# Altium schematic sheet connector.SchDoc
size A4; SPICEModelCacheDOTMRQIM: <root> / <DocumentId>DOTMRQIM</DocumentId> / <CacheFrame Number="0"> / <Model Name="npn" Kind="MDL"> / <Text>*Default NPN BJT / *NPN Trans Pinout: C,B,E / .MODEL NPN NPN()</Text> / </Model> / </CacheFrame> / </root>
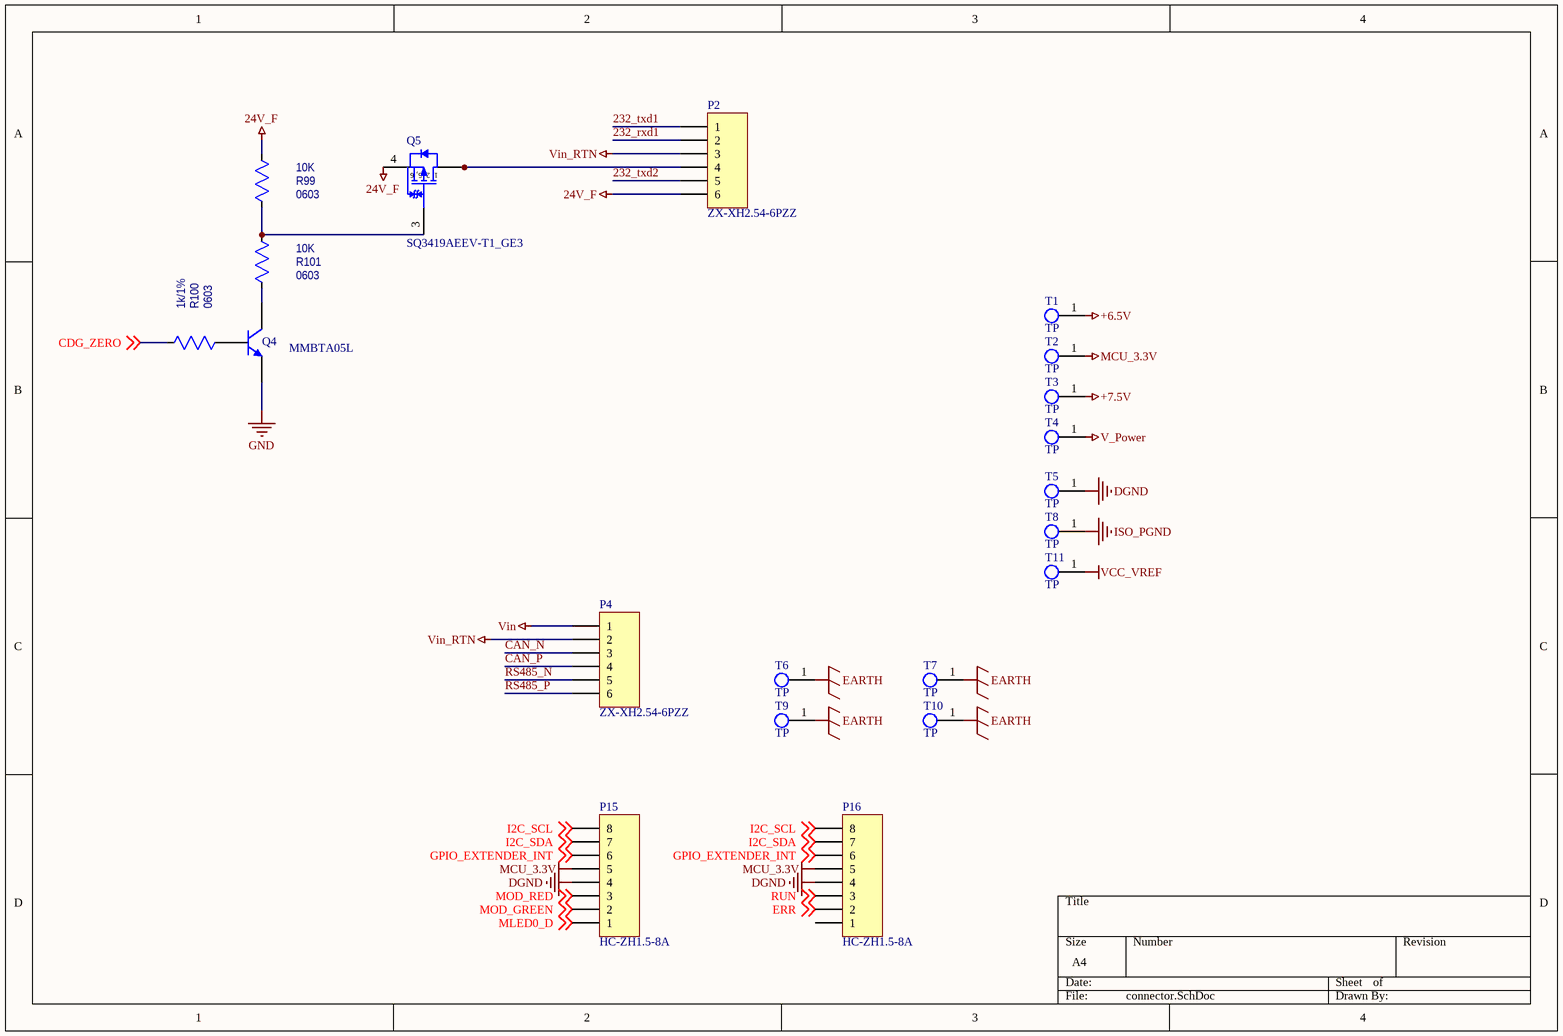
[diagram p0: connector.SchDoc]

## Parts
P2  ZX-XH2.54-6PZZ  [6X2.54MMZ]
P4  ZX-XH2.54-6PZZ  [6X2.54MMZ]
P15  HC-ZH1.5-8A  [CONN-TH_HC-ZH1.5-8A]
P16  HC-ZH1.5-8A  [CONN-TH_HC-ZH1.5-8A]
Q4  MMBTA05L  [sot23-3]
Q5  SQ3419AEEV-T1_GE3  [VISH-TSOP-6_V]  (no BOM)
R99  Package: 0603  [RESC1608X055N_0603]  (hidden comment: 10K)
R100  Package: 0603  [RESC1608X055N_0603]  (hidden comment: 1k/1%)
R101  Package: 0603  [RESC1608X055N_0603]  (hidden comment: 10K)
T1  TP  [TPD]
T2  TP  [TPD]
T3  TP  [TPD]
T4  TP  [TPD]
T5  TP  [TPD]
T6  TP  [FIX-4.5]
T7  TP  [FIX-4.5]
T8  TP  [TPD]
T9  TP  [FIX-4.5]
T10  TP  [FIX-4.5]
T11  TP  [TPD]

## Nets
24V_F: P2.6 Q5.4(S) R99.1
+6.5V: T1.1
+7.5V: T3.1
DGND: P15.4 P16.4 T5.1
EARTH: T6.1 T7.1 T9.1 T10.1
GND: Q4.2(E)
ISO_PGND: T8.1
MCU_3.3V: P15.5 P16.5 T2.1
V_Power: T4.1
VCC_VREF: T11.1
Vin: P4.1
Vin_RTN: P2.3 P4.2
232_rxd1: P2.2
232_txd1: P2.1
232_txd2: P2.5
CAN_N: P4.3
CAN_P: P4.4
CDG_ZERO: R100.1 ; off-sheet CDG_ZERO
ERR: P16.2 ; off-sheet ERR
GPIO_EXTENDER_INT: P15.6 P16.6 ; off-sheet GPIO_EXTENDER_INT
I2C_SCL: P15.8 P16.8 ; off-sheet I2C_SCL
I2C_SDA: P15.7 P16.7 ; off-sheet I2C_SDA
MLED0_D: P15.1 ; off-sheet MLED0_D
MOD_GREEN: P15.2 ; off-sheet MOD_GREEN
MOD_RED: P15.3 ; off-sheet MOD_RED
RS485_N: P4.5
RS485_P: P4.6
RUN: P16.3 ; off-sheet RUN
NetP2_4: P2.4 Q5.1(D) Q5.2(D) Q5.5(D) Q5.6(D)
NetQ4_1: Q4.1(B) R100.2
NetQ4_3: Q4.3(C) R101.2
NetQ5_3: Q5.3(G) R99.2 R101.1

Not connected (* = marked no-connect by the designer): P16 1

## Notes on the sheet
- (in symbol SQ3419AEEV-T1_GE3) 1, 2, 5, 6

## Library data of the parts
P2 P4 = Header 6: Publisher: Altium Limited; Value: ZX-XH2.54-6PZZ; PartNumber: ZX-XH2.54-6PZZ
P15 P16 = Header 8: Header, 8-Pin; LatestRevisionDate: 17-Jul-2002; LatestRevisionNote: Re-released for DXP Platform.; Publisher: Altium Limited; Value: HC-ZH1.5-8A; PartNumber: HC-ZH1.5-8A
Q4 = NPN: NPN Bipolar Transistor; Published: 8-Jun-2000; LatestRevisionDate: 17-Jul-2002; LatestRevisionNote: Re-released for DXP Platform.; PackageReference: TO-226; Publisher: Altium Limited; Code_JEDEC: TO-226-AA; PartNumber: MMBTA05L
Q5 = SQ3419AEEV-T1_GE3: Automotive P-Channel MOSFET, 6.9 A, 40 V, -55 to 175 degC, 6-Pin TSOP, RoHS, Tape and Reel; Manufacturer: International Rectifier; PartNumber: PMN50XP-VB; Rated Power Dissipation: 2W; Qg Gate Charge: 25nC; Drain-to-Source Voltage [Vdss]: 40V; Drain-Source On Resistance-Max: 112mO; Channel Type: P-Channel; Package Description: 6-Pin Thin Small Outline Package, Body 3 x 1.65 mm, Pitch 1.00 mm; Datasheet URL: https://www.vishay.com/docs/65332/sq3419aeev.pdf; Mounting Technology: SurfaceMount; Package Reference: TSOP-6; Manufacturer URL: https://www.vishay.com/; Datasheet Version: 04/2010
R99 R101 = Resistor_0603: Resistor, Standard; PartNumber: RC0603FR-0710KL; TempCo: [tempco]; Tolerance: tol; ComponentLink1URL: *; ComponentLink1Description: Datasheet; Value: 10K; SupplierDescription: RES SMD 0 OHM JUMPER 1/10W 0603
R100 = Resistor_0603: Resistor, Standard; PartNumber: RC0603FR-071KL; TempCo: [tempco]; Tolerance: tol; ComponentLink1URL: *; ComponentLink1Description: Datasheet; Value: 1k/1%; SupplierDescription: RES SMD 0 OHM JUMPER 1/10W 0603